# EAGLE design okkb-pic-badge (EAGLE 9.6.2)
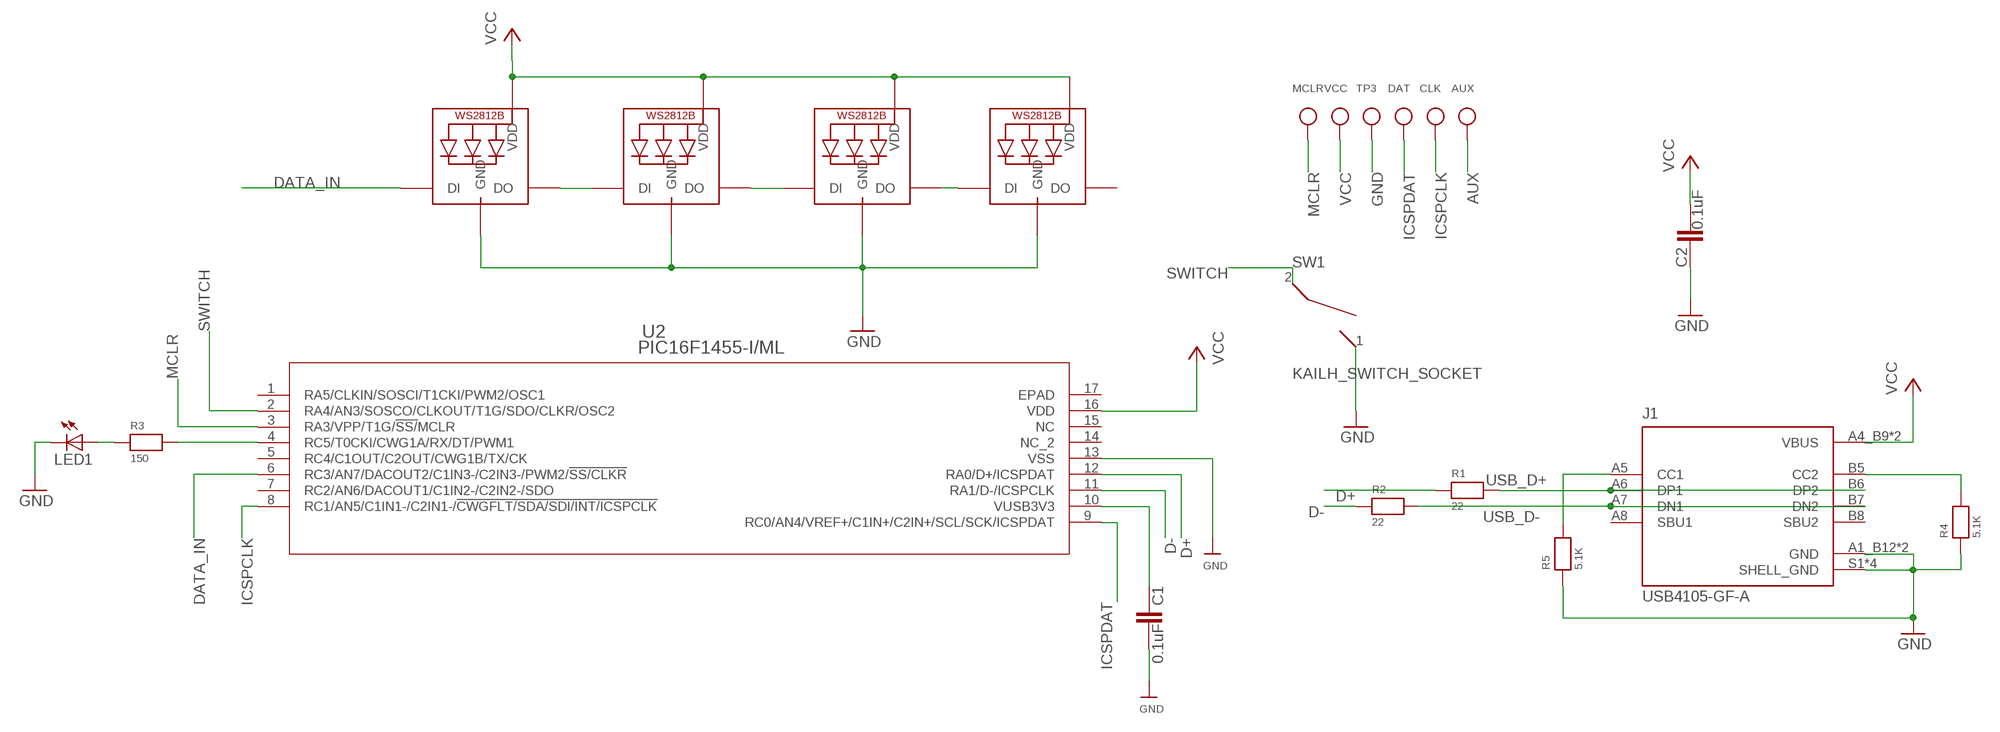
[diagram p0: schematic, sheet 1]

## Parts
AUX  TESTPOINTROUND1MM  [TESTPOINT_ROUND_1MM]
C1  0.1uF  CAPACITOR-C0805  [C0805]
C2  0.1uF  CAPACITOR-C0805  [C0805]
CLK  TESTPOINTROUND1MM  [TESTPOINT_ROUND_1MM]
DAT  TESTPOINTROUND1MM  [TESTPOINT_ROUND_1MM]
J1  USB4105-GF-A  [GCT_USB4105-GF-A]
LED1  LEDCHIPLED_1206  [CHIPLED_1206]
LED2  WS2812B3535  [LED3535]
LED3  WS2812B3535  [LED3535]
LED4  WS2812B3535  [LED3535]
LED5  WS2812B3535  [LED3535]
MCLR  TESTPOINTROUND1MM  [TESTPOINT_ROUND_1MM]
R1  22  RESISTOR0805  [0805]
R2  22  RESISTOR0805  [0805]
R3  150  RESISTOR_0805  [_0805]
R4  5.1K  RESISTOR0805  [0805]
R5  5.1K  RESISTOR0805  [0805]
SW1  KAILH_SWITCH_SOCKET  [SWITCH_SOCKET]
TP3  TESTPOINTROUND1MM  [TESTPOINT_ROUND_1MM]
U2  PIC16F1455-I/ML  [QFN16_4X4MC]
VCC  TESTPOINTROUND1MM  [TESTPOINT_ROUND_1MM]

## Nets
AUX: AUX.P$1
D+: R1.1 U2.12(RA0/D+/ICSPDAT)
D-: R2.1 U2.11(RA1/D-/ICSPCLK)
DATA_IN: LED2.1(DI) U2.6(RC3/AN7/DACOUT2/C1IN3-/C2IN3-/PWM2/!SS/CLKR)
GND: C1.2 C2.1 J1.A1_B12(GND) J1.B1_A12(GND) J1.S1(SHELL_GND) J1.S2(SHELL_GND) J1.S3(SHELL_GND) J1.S4(SHELL_GND) LED1.C LED2.4(GND) LED3.4(GND) LED4.4(GND) LED5.4(GND) R4.1 R5.1 SW1.1 TP3.P$1 U2.13(VSS)
ICSPCLK: CLK.P$1 U2.8(RC1/AN5/C1IN1-/C2IN1-/!CWGFLT/SDA/SDI/INT/ICSPCLK)
ICSPDAT: DAT.P$1 U2.9(RC0/AN4/VREF+/C1IN+/C2IN+/SCL/SCK/ICSPDAT)
MCLR: MCLR.P$1 U2.3(RA3/VPP/T1G/!SS/!MCLR)
N$1: R3.2 U2.4(RC5/T0CKI/CWG1A/RX/DT/PWM1)
N$2: LED1.A R3.1
N$3: C1.1 U2.10(VUSB3V3)
N$4: LED2.3(DO) LED3.1(DI)
N$5: LED3.3(DO) LED4.1(DI)
N$6: LED4.3(DO) LED5.1(DI)
N$7: J1.A5(CC1) R5.2
N$8: J1.B5(CC2) R4.2
SWITCH: SW1.2 U2.2(RA4/AN3/SOSCO/CLKOUT/T1G/SDO/CLKR/OSC2)
USB_D+: J1.A6(DP1) J1.B6(DP2) R1.2
USB_D-: J1.A7(DN1) J1.B7(DN2) R2.2
VCC: C2.2 J1.A4_B9(VBUS) J1.B4_A9(VBUS) LED2.2(VDD) LED3.2(VDD) LED4.2(VDD) LED5.2(VDD) U2.16(VDD) VCC.P$1
Unconnected: J1.A8(SBU1) J1.B8(SBU2) LED5.3(DO) U2.1(RA5/CLKIN/SOSCI/T1CKI/PWM2/OSC1) U2.5(RC4/C1OUT/C2OUT/CWG1B/TX/CK) U2.7(RC2/AN6/DACOUT1/C1IN2-/C2IN2-/SDO) U2.14(NC_2) U2.15(NC) U2.17(EPAD)

## Library data of the parts
AUX CLK DAT MCLR TP3 VCC = microbuilder:TESTPOINT: Test Point Various test points for characterisation and PCB testing TESTPOINT_SMT - Compact Surface Mount Test Point [Digikey: 5016KTR-ND]
C1 C2 = Controller:CAPACITOR
J1 = USB4105-GF-A:USB4105-GF-A: USB-C (USB TYPE-C) USB 2.0 Receptacle Connector 24 (16+8 Dummy) Position Surface Mount, Right Angle; Through Hole Check availability <https://pricing.snapeda.com/parts/USB4105-GF-A/GCT/view-part?ref=eda>; AVAILABILITY: In Stock; DESCRIPTION: USB-C (USB TYPE-C) USB 2.0 Receptacle Connector 24 (16+8 Dummy) Position Surface Mount, Right Angle; Through Hole; MF: GCT; MP: USB4105-GF-A; PACKAGE: None; PRICE: None; PURCHASE-URL: https://pricing.snapeda.com/search/part/USB4105-GF-A/?ref=eda
LED1 = adafruit:LED: LED OSRAM: - CHIPLED LG R971, LG N971, LY N971, LG Q971, LY Q971, LO R971, LY R971 LH N974, LH R974 LS Q976, LO Q976, LY Q976 LO Q996 - Hyper CHIPLED LW Q18S LB Q993, LB Q99A, LB R99A - SideLED LS A670, LO A670, LY A670, LG A670, LP A670 LB A673, LV A673, LT A673, LW A673 LH A674 LY A675 LS A676, LA A676, LO A676, LY A676, LW A676 LS A679, LY A679, LG A679 - Hyper Micro SIDELED® LS Y876, LA Y876, LO Y876, LY Y876 LT Y87S - SmartLED LW L88C, LW L88S LB L89C, LB L89S, LG L890 LS L89K, LO L89K, LY L89K LS L896, LA L896, LO L896, LY L896 - TOPLED LS T670, LO T670, LY T670, LG T670, LP T670 LSG T670, LSP T670, LSY T670, LOP T670, LYG T670 LG T671, LOG T671, LSG T671 LB T673, LV T673, LT T673, LW T673 LH T674 LS T676, LA T676, LO T676, LY T676, LB T676, LH T676, LSB T676, LW T676 LB T67C, LV T67C, LT T67C, LS T67K, LO T67K, LY T67K, LW E67C LS E67B, LA E67B, LO E67B, LY E67B, LB E67C, LV E67C, LT E67C LW T67C LS T679, LY T679, LG T679 LS T770, LO T770, LY T770, LG T770, LP T770 LB T773, LV T773, LT T773, LW T773 LH T774 LS E675, LA E675, LY E675, LS T675 LS T776, LA T776, LO T776, LY T776, LB T776 LHGB T686 LT T68C, LB T68C - Hyper Mini TOPLED® LB M676 - Mini TOPLED Santana® LG M470 LS M47K, LO M47K, LY M47K Source: http://www.osram.convergy.de/
LED2-LED5 = adafruit:WS2812B
R1-R5 = microbuilder:RESISTOR: Resistors 0402 - 0402 Surface Mount Package 22 Ohm 1% 1/16W [Digikey: 311-22.0LRTR-ND] 33 Ohm 5% 1/16W 1.0K 5% 1/16W 1.5K 5% 1/16W 2.0K 1% 1/16W 10.0K 1% 1/16W [Digikey: 311-10.0KLRTR-ND] 10.0K 5% 1/16W [Digikey: RMCF0402JT10K0TR-ND] 12.1K 1% 1/16W [Digikey: 311-22.0LRTR-ND] 100.0K 5% 1/16W 0603 - 0603 Surface Mount Package 0 Ohm 1/10 Watt 1% Resistor 15 Ohm 1/10 Watt 1% Resistor 33 Ohm 1/10 Watt 1% Resistor 49.9 Ohm 1/10 Watt 1% Resistor 100 Ohm 1/10 Watt 1% Resistor 150 Ohm 1/10 Watt 1% Resistor 240 Ohm 1/10 Watt 1% Resistor 390 Ohm 1/10 Watt 1% Resistor 560 Ohm 1/10 Watt 1% Resistor 680 Ohm 1/10 Watt 1% Resistor 750 Ohm 1/10 Watt 1% Resistor 1.0K Ohm 1/10 Watt 1% Resistor 1.5K Ohm 1/10 Watt 1% Resistor 2.0K Ohm 1/10 Watt 1% Resistor 2.2K Ohm 1/10 Watt 1% Resistor 3.3K Ohm 1/10 Watt 1% Resistor 4.7K Ohm 1/10 Watt 1% Resistor 10.0K Ohm 1/10 Watt 1% Resistor 12.0K Ohm 1/10 Watt 1% Resistor 12.1K Ohm 1/10 Watt 1% Resistor 20.0K Ohm 1/10 Watt 1% Resistor 33.0K Ohm 1/10 Watt 1% Resistor 100.0K Ohm 1/10 Watt 1% Resistor 0805 - 0805 Surface Mount Package 0 Ohm 1/8 Watt 1% Resistor 33 Ohm 1/8 Watt 1% Resistor 100 Ohm 1/8 Watt 1% Resistor 150 Ohm 1/8 Watt 1% Resistor 200 Ohm 1/8 Watt 1% Resistor 240 Ohm 1/8 Watt 1% Resistor 330 Ohm 1/8 Watt 1% Resistor 390 Ohm 1/8 Watt 1% Resistor 470 Ohm 1/8 Watt 1% Resistor 1.0K Ohm 1/8 Watt 1% Resistor 1.5K Ohm 1/8 Watt 1% Resistor 2.0K Ohm 1/8 Watt 1% Resistor 4.7K Ohm 1/8 Watt 1% Resistor 5.1K Ohm 1/8 Watt 1% Resistor 5.6K Ohm 1/8 Watt 1% Resistor 10.0K Ohm 1/8 Watt 1% Resistor 22.0K Ohm 1/8 Watt 1% Resistor 33.0K Ohm 1/8 Watt 1% Resistor 100K Ohm 1/8 Watt 1% Resistor 1206 - 1206 Surface Mount Package 2012 - 2010 Surface Mount Package 0.11 Ohm 1/2 Watt 1% Resistor - Digikey: RHM.11UCT-ND
SW1 = Kailh_switch_socket:KAILH_SWITCH_SOCKET
U2 = Microchip_By_element14_Batch_1:PIC16F1455-I/ML; MANUFACTURER_PART_NUMBER: pic16f1455iml; VENDOR: Microchip

## Net classes
1 PWR: width 0.254 mm

## Board
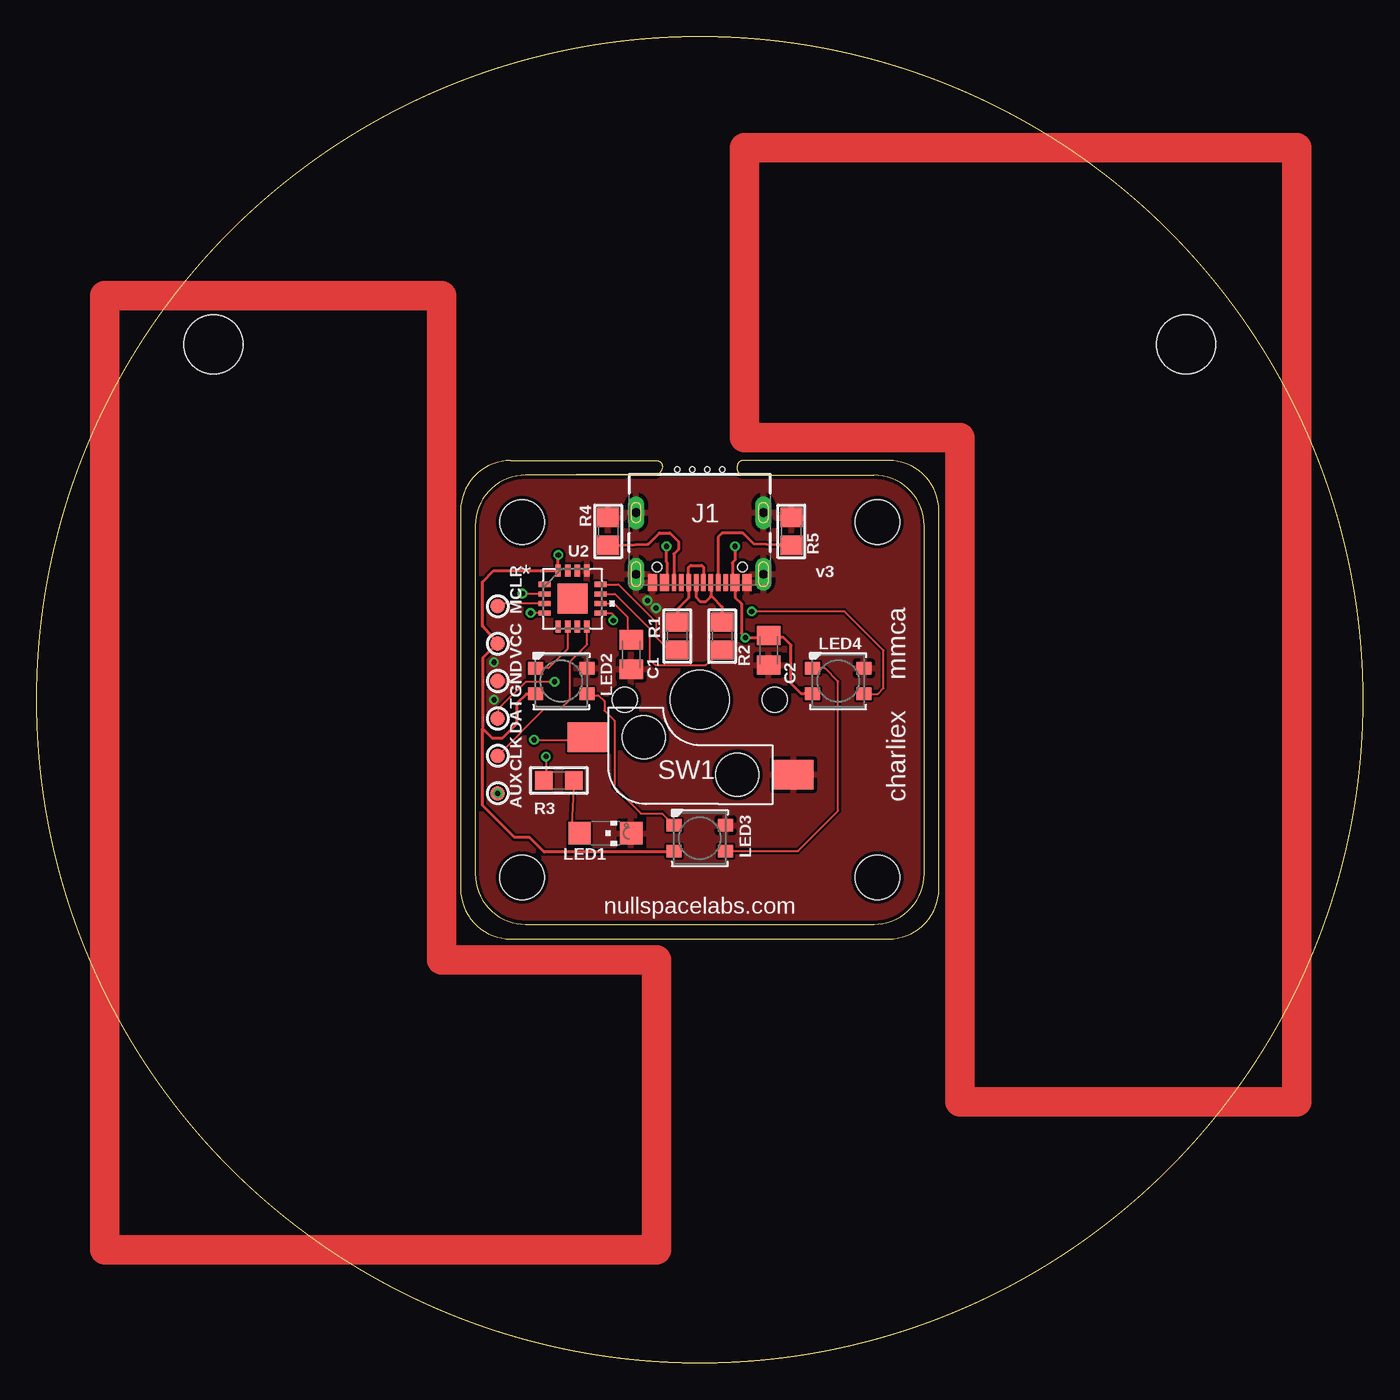
[diagram p1: board, top side]
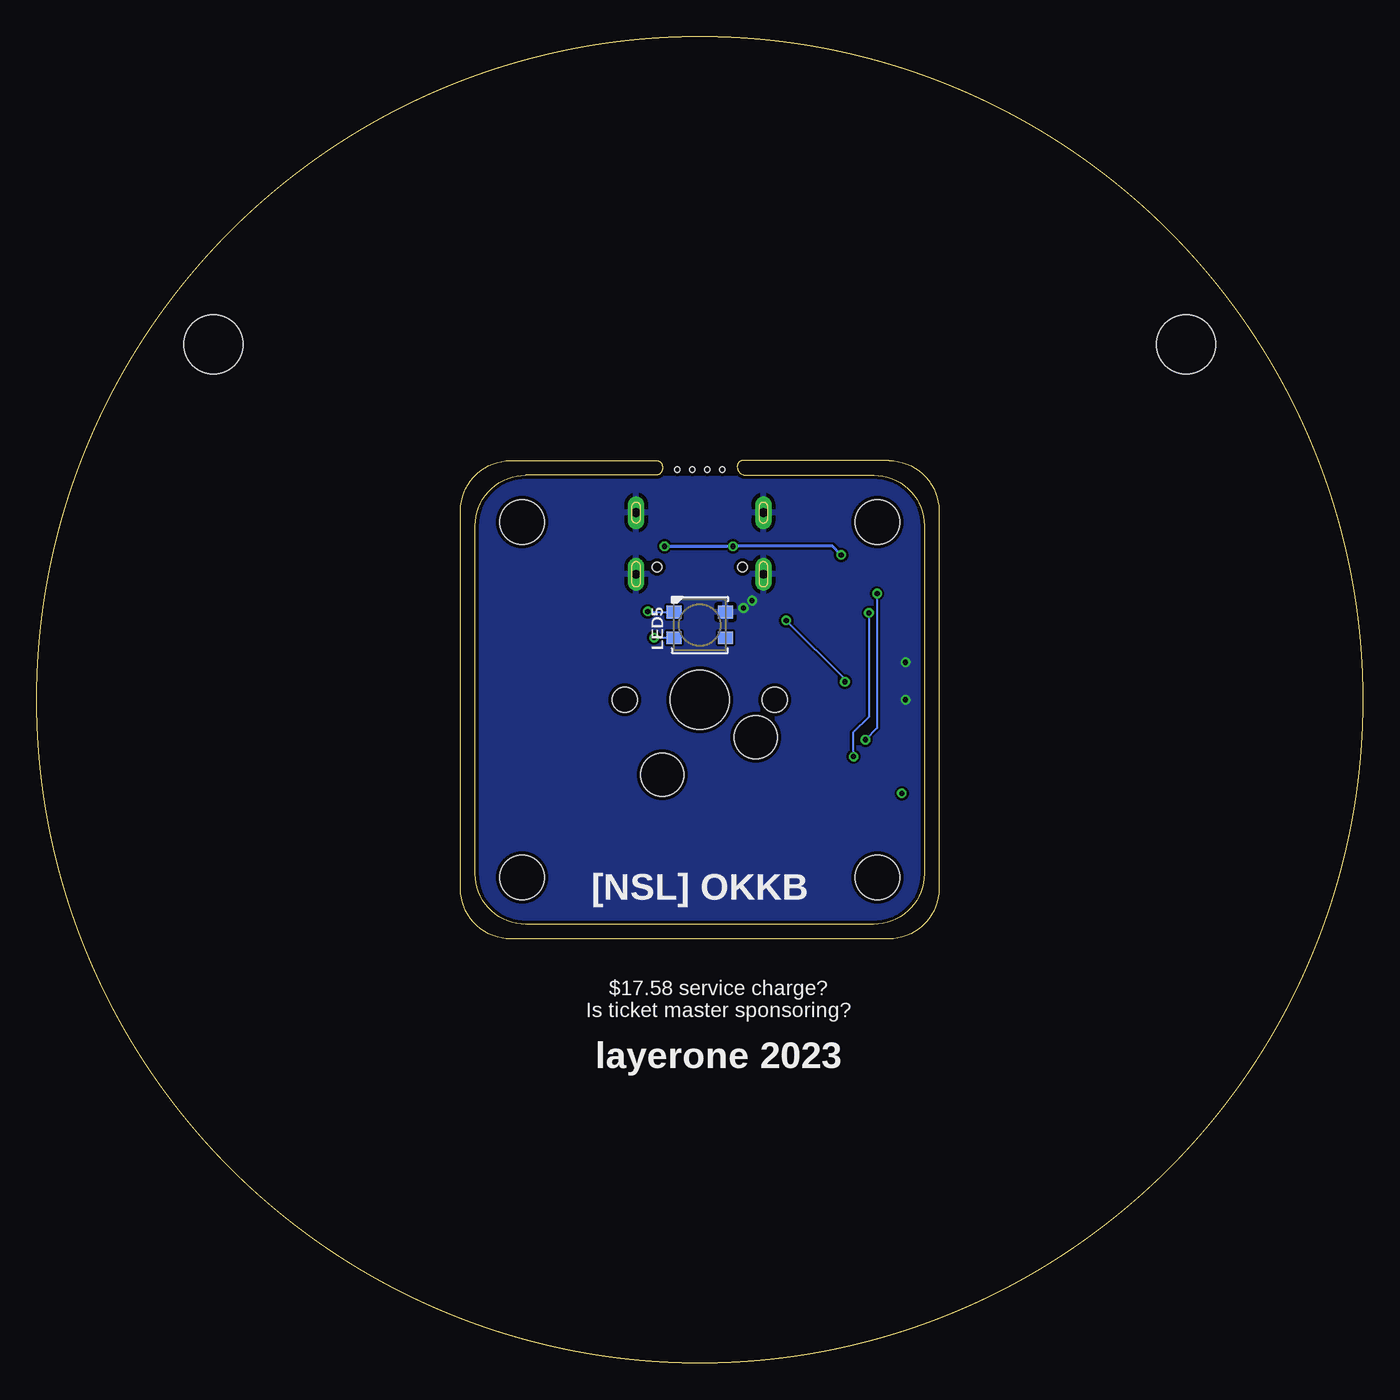
[diagram p2: board, bottom side, seen from below]

Size 90 x 90 mm. Coordinates in mm from the lower left corner, seen from the top.
Outline: 33.19,29.76 56.81,29.76 arc90 60.24,33.19 60.24,56.81 arc90 56.81,60.24 47.97,60.24 arc-90 47.54,60.67 47.54,60.83 arc-90 47.95,61.24 57.83,61.24 arc-90 61.24,57.83 61.24,32.17 arc-90 57.83,28.76 32.17,28.76 arc-90 28.76,32.17 28.76,57.83 arc-90 32.17,61.24 42.05,61.24 arc-90 42.46,60.83 arc-90 41.87,60.24 33.19,60.24 arc90 29.76,56.81 29.76,33.19 arc90 33.19,29.76
Outline: circle at 45,45 radius 45
Copper layers (1*16): Top 0.035mm / dielectric 1.5mm / Bottom 0.035mm
Design rules "ITEADstudio_DRC": minimum track width 6mil, minimum drill 12mil, track to track 6mil, track to pad 6mil, pad to pad 6mil, via to via 6mil, smd to smd 0mil, copper to edge 10mil, drill to drill 10mil, minimum pad ring 10mil, minimum via ring 6mil, stop-mask expansion 2mil, vias tented up to drill 100mil, thermal gap 10mil
Holes 3 mm at 57.06,57.06 57.06,32.94 32.94,32.94 32.94,57.06
Holes 0.35 mm at 43.48,60.62 44.49,60.62 46.52,60.62 45.51,60.62
Holes 4 mm at 78.02,69.13 11.98,69.13

### Footprints (pad centres in the part's own frame; a part is rotated, then mirrored left to right if it is on the bottom)
TESTPOINT_ROUND_1MM = smd 1 x 1: P$1 0,0
C0805 = smd 1.3 x 1.6: 1 -1,0; 2 1,0
GCT_USB4105-GF-A = smd 0.6 x 1.15: A1_B12 -3.2,4.755; A4_B9 -2.4,4.755; B1_A12 3.2,4.755; B4_A9 2.4,4.755 | smd 0.3 x 1.15: A5 -1.25,4.755; A6 -0.25,4.755; A7 0.25,4.755; A8 1.25,4.755; B5 1.75,4.755; B6 0.75,4.755; B7 -0.75,4.755; B8 -1.75,4.755 | drill 0.6 pad 1.05 long: S1 -4.32,4.18; S4 4.32,4.18 | drill 0.6 pad 1 long: S2 -4.32,0; S3 4.32,0 | hole 0.65: 2.89,3.68; -2.89,3.68
CHIPLED_1206 = smd 1.5 x 1.5: A 0,-1.75; C 0,1.75
LED3535 = smd 1 x 0.85: 1 -1.75,0.875; 2 -1.75,-0.875; 3 1.75,-0.875; 4 1.75,0.875
0805 = smd 1.3 x 1.5: 1 -0.95,0; 2 0.95,0
_0805 = smd 1.2 x 1.3: 1 -1.016,0; 2 1.016,0
SWITCH_SOCKET = smd 2.7 x 2 bottom: 1 6.355,5.08; 2 -7.625,2.54 | hole 4: 0,0 | hole 2.93: -3.81,2.54; 2.54,5.08 | hole 1.7: -5.08,0; 5.08,0
QFN16_4X4MC = smd 0.813 x 0.356: 1 -1.898,0.975; 2 -1.898,0.325; 3 -1.898,-0.325; 4 -1.898,-0.975; 9 1.898,-0.975; 10 1.898,-0.325; 11 1.898,0.325; 12 1.898,0.975 | smd 0.356 x 0.813: 5 -0.975,-1.898; 6 -0.325,-1.898; 7 0.325,-1.898; 8 0.975,-1.898; 13 0.975,1.898; 14 0.325,1.898; 15 -0.325,1.898; 16 -0.975,1.898 | smd 2.032 x 2.032: 17 0,0

### Placement (x,y rotation side)
AUX  31.28,38.65 0 top
C1  40.35,48.07 270 top
C2  49.67,48.35 90 top
CLK  31.28,41.19 0 top
DAT  31.28,43.73 0 top
J1  45,57.7 180 top
LED1  38.6,35.94 270 top
LED2  35.6,46.27 0 top
LED3  45,35.6 0 top
LED4  54.4,46.27 0 top
LED5  45,50.08 0 bottom
MCLR  31.28,51.35 0 top
R1  43.48,49.32 90 top
R2  46.52,49.32 90 top
R3  35.44,39.52 180 top
R4  38.78,56.43 270 top
R5  51.22,56.43 270 top
SW1  45,45 180 bottom
TP3  31.28,46.27 0 top
U2  36.36,51.86 0 top
VCC  31.28,48.81 0 top

### Tracks (layer width: path | path; a pad name or v marks a point on that pad's centre or on a via)
AUX  (via drill 0.35)
  other vias: 31.28,38.65
D+
  Top 0.152: U2.12 39.48,52.83 42.03,50.28 42.03,49.27 42.83,48.47 R1.1
D-
  Top 0.152: U2.11 39.24,52.18 41.6,49.83 41.6,47.74 41.98,47.36 45.42,47.36 R2.1
DATA_IN
  Top 0.152: U2.6 36.04,48.46 34.72,47.15 LED2.1
GND  (via drill 0.35)
  other vias: 31.03,47.54 31.03,45 41.44,51.73 42.03,51.22
  pour Top: 60.27,59.94 60.27,29.84 29.66,29.84 29.66,59.94
  pour Bottom: 59.99,59.99 59.99,30.01 29.91,30.01 29.91,59.99
ICSPCLK
  Top 0.152: CLK.P$1 34.42,44.37 35.53,44.37 36.19,45.02 36.19,47.59 37.36,48.76 37.36,49.94 U2.8
ICSPDAT  (via drill 0.35)
  Top 0.152: U2.9 39.02,50.88 39.13,50.77 v39.13,50.38 | v35.14,46.22 33.19,46.22 31.33,44.36 DAT.P$1
  Bottom 0.152: v39.13,50.38 35.14,46.4 v35.14,46.22
MCLR
  Top 0.152: U2.3 31.55,51.53 MCLR.P$1
N$1  (via drill 0.35)
  Top 0.152: U2.4 v33.53,50.88 v33.52,50.89 | v34.56,41.14 34.56,39.54 R3.2
  Bottom 0.152: v33.52,50.89 33.52,43.83 34.59,42.77 34.59,41.14 v34.56,41.14
N$2
  Top 0.152: R3.1 36.29,36.5 LED1.A
N$3
  Top 0.152: U2.10 39.18,51.53 40.1,50.61 40.1,49.2 C1.1
N$4
  Top 0.152: LED2.3 37.44,45.3 38.12,45.3 38.52,44.9 38.52,44.26 39.21,43.58 39.21,39.13 39.18,39.11 41.01,37.28 42.45,37.28 LED3.1
N$5
  Top 0.152: LED3.3 51.67,34.73 54.4,37.46 54.4,46.24 53.5,47.15 LED4.1
N$6  (via drill 0.35)
  Top 0.152: LED4.3 57.08,45.4 57.47,45.79 57.47,48.35 54.83,50.99 v48.53,50.99
  Bottom 0.152: v48.53,50.99 48.49,50.95 LED5.1
N$7
  Top 0.203: R5.2 48.67,55.58 47.95,56.3 46.52,56.3 46.25,56.03 J1.A5
N$8
  Top 0.203: R4.2 41.51,55.58 42.26,56.33 42.97,56.33 43.55,55.74 43.55,55.21 43.25,54.91 J1.B5
N$9
  Top 2: 62.65,17.7 85.51,17.7
N$10
  Top 2: 85.51,17.7 85.51,82.47
N$11
  Top 2: 85.51,82.47 48.05,82.47
N$12
  Top 2: 48.05,82.47 48.05,62.78
N$13
  Top 2: 48.05,62.78 62.65,62.78
N$14
  Top 2: 62.65,17.7 62.65,62.78
N$15
  Top 2: 27.47,72.43 4.61,72.43
N$16
  Top 2: 4.61,72.43 4.61,7.66
N$17
  Top 2: 4.61,7.66 42.08,7.66
N$18
  Top 2: 42.08,7.66 42.08,27.35
N$19
  Top 2: 42.08,27.35 27.47,27.35
N$20
  Top 2: 27.47,72.43 27.47,27.35
SWITCH  (via drill 0.35)
  Top 0.152: U2.2 32.99,52.18 v32.96,52.21 | v33.75,42.28 37.2,42.28 SW1.2
  Bottom 0.152: v32.96,52.21 32.96,43.07 v33.75,42.28
USB_D+
  Top 0.203: R1.2 43.48,51.15 44.25,51.92 J1.B6 44.25,53.98 44.39,54.12 45.15,54.12 45.25,54.02 J1.A6
USB_D-
  Top 0.203: J1.B7 45.75,52.07 45.79,52.04 | R2.2 46.52,51.3 45.79,52.04 | J1.A7 44.75,51.96 45.02,51.68 45.43,51.68 45.79,52.04
VCC  (via drill 0.35)
  Top 0.152: U2.16 | 30.27,43.12 30.27,43.04 | v48.1,49.22 | J1.A4_B9 | 43.19,34.66 LED3.2
  Top 0.203: 47.31,53.03 J1.A4_B9 | J1.A4_B9 47.36,52.98 | U2.16 31.01,53.76 30.24,53 30.24,49.99 VCC.P$1 30.27,47.84 30.27,43.12 | LED2.2 33.23,45.4 32.61,44.77 32.61,43.4 31.59,42.38 30.93,42.38 30.27,43.04 30.27,37.81 32.43,35.65 33.44,35.65 34.43,34.66 43.19,34.66 | 49.66,49.22 v48.1,49.22 47.82,49.5 47.82,51.53 47.4,51.95 J1.A4_B9 | 49.66,49.22 C2.2 | LED4.2 51.92,45.4 51.2,46.12 51.2,48.71 50.69,49.22 49.66,49.22 | U2.16 35.39,54.82 v35.4,54.83 | v42.74,55.41 42.74,54.35 42.79,54.3 42.79,53.14 J1.B4_A9 | v47.39,55.41 47.39,54.48 47.21,54.3 47.21,53.14 J1.A4_B9
  Bottom 0.152: LED5.2 48.09,49.2 v48.1,49.22
  Bottom 0.203: v47.39,55.41 v42.74,55.41 42.71,55.44 36.01,55.44 v35.4,54.83

### Text on the board
tPlace: mmca | charliex | nullspacelabs.com
bPlace: [NSL] OKKB
tNames: v3 | GND
bNames: $17.58 service charge? / Is ticket master sponsoring? | layerone 2023